# EAGLE schematic Motherboard (EAGLE 9.5.0)
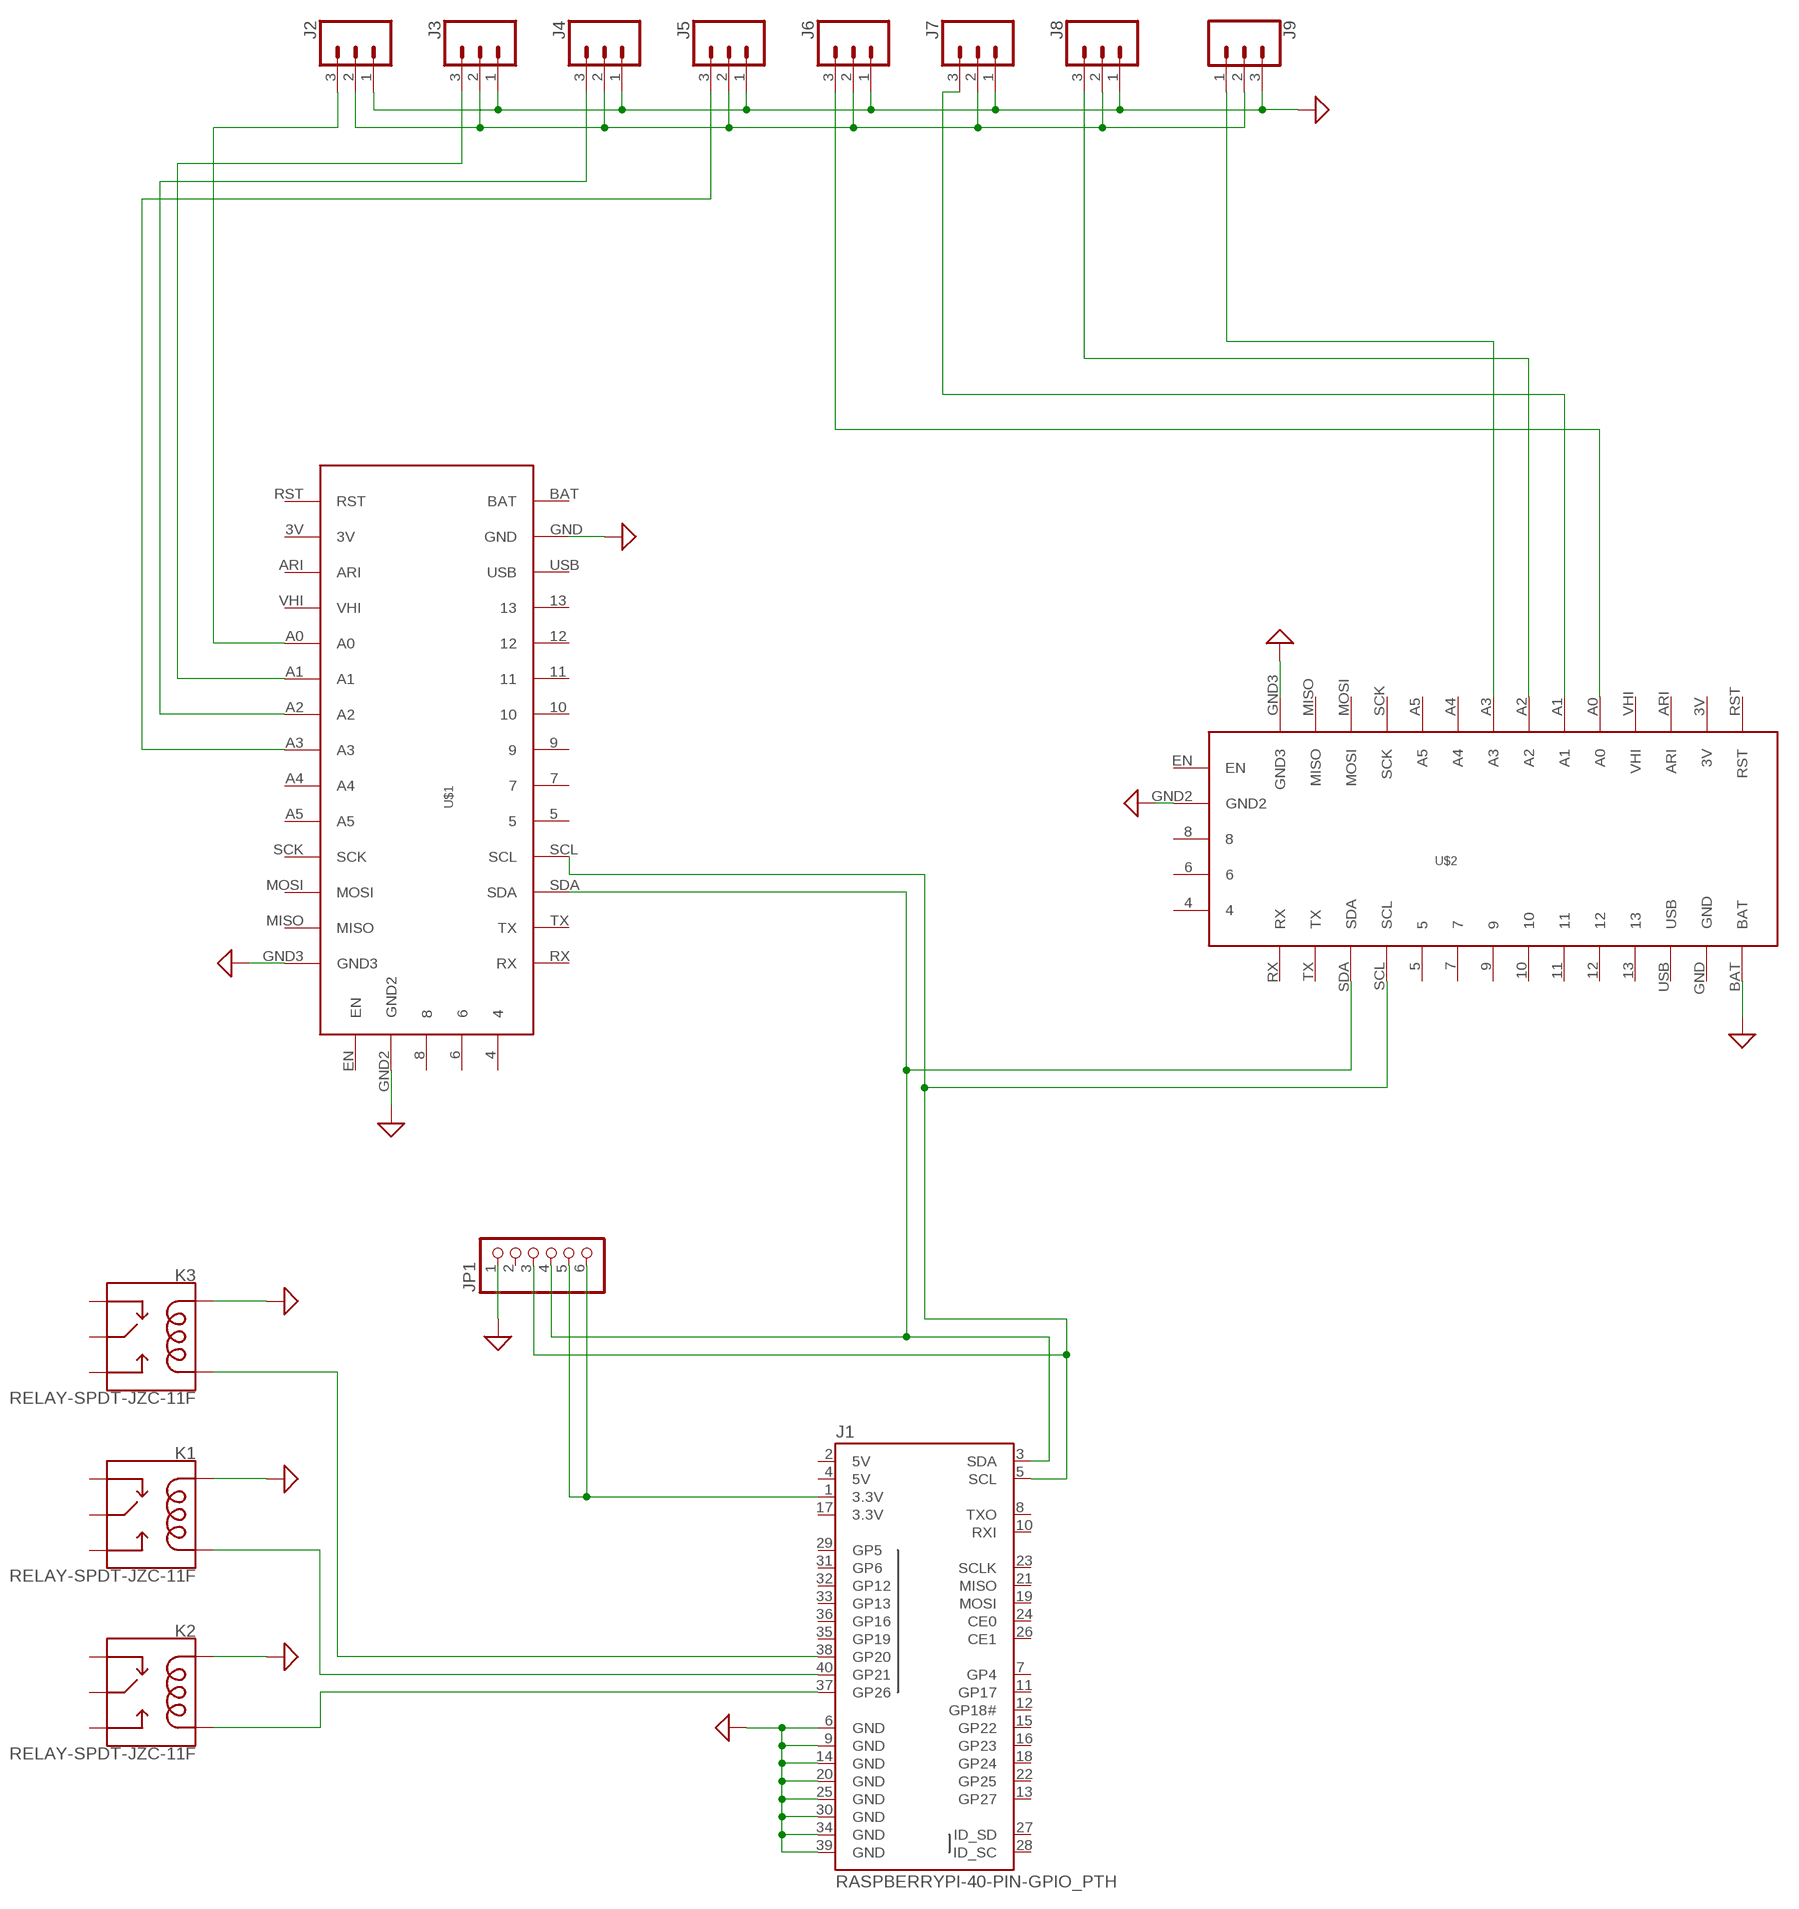
[diagram p0: schematic, sheet 1]

## Parts
J1  RASPBERRYPI-40-PIN-GPIO_PTH  [2X20_SHROUDED]
J2  CONN_03JST-PTH  [JST-3-PTH]
J3  CONN_03JST-PTH  [JST-3-PTH]
J4  CONN_03JST-PTH  [JST-3-PTH]
J5  CONN_03JST-PTH  [JST-3-PTH]
J6  CONN_03JST-PTH  [JST-3-PTH]
J7  CONN_03JST-PTH  [JST-3-PTH]
J8  CONN_03JST-PTH  [JST-3-PTH]
J9  CONN_03JST-PTH  [JST-3-PTH]
JP1  PINHD-1X6B  [1X06-BIG]
K1  RELAY-SPDT-JZC-11F  [RELAY-JZC]
K2  RELAY-SPDT-JZC-11F  [RELAY-JZC]
K3  RELAY-SPDT-JZC-11F  [RELAY-JZC]
U$1  ITSY_BITSY  [ITSY_BITSY]
U$2  ITSY_BITSY  [ITSY_BITSY]

## Nets
GND: J1.6(GND) J1.9(GND) J1.14(GND) J1.20(GND) J1.25(GND) J1.30(GND) J1.34(GND) J1.39(GND) J2.1 J3.1 J4.1 J5.1 J6.1 J7.1 J8.1 J9.3 JP1.1 K1.5(COIL1) K2.5(COIL1) K3.5(COIL1) U$1.GND U$1.GND2 U$1.GND3 U$2.BAT U$2.GND2 U$2.GND3 ; supply symbol labelled SUP
N$1: J1.3(SDA) JP1.4 U$1.SDA U$2.SDA
N$2: J1.5(SCL) JP1.3 U$1.SCL U$2.SCL
N$3: J2.2 J3.2 J4.2 J5.2 J6.2 J7.2 J8.2 J9.2
N$4: J2.3 U$1.A0
N$5: J1.37(GP26) K2.1(COIL2)
N$6: J3.3 U$1.A1
N$7: J4.3 U$1.A2
N$8: J5.3 U$1.A3
N$9: J6.3 U$2.A0
N$10: J1.40(GP21) K1.1(COIL2)
N$11: J7.3 U$2.A1
N$12: J8.3 U$2.A2
N$13: J9.1 U$2.A3
N$14: J1.38(GP20) K3.1(COIL2)
N$17: J1.1(3.3V) JP1.5 JP1.6
Unconnected: J1.7(GP4) J1.8(TXO) J1.10(RXI) J1.11(GP17) J1.12(GP18#) J1.13(GP27) J1.15(GP22) J1.16(GP23) J1.18(GP24) J1.19(MOSI) J1.21(MISO) J1.22(GP25) J1.23(SCLK) J1.24(CE0) J1.26(CE1) J1.27(ID_SD) J1.28(ID_SC) J1.29(GP5) J1.31(GP6) J1.32(GP12) J1.33(GP13) J1.35(GP19) J1.36(GP16) JP1.2 K1.2(NC) K1.3(NO) K1.4(MAIN) K2.2(NC) K2.3(NO) K2.4(MAIN) K3.2(NC) K3.3(NO) K3.4(MAIN) U$1.3V U$1.4 U$1.5 U$1.6 U$1.7 U$1.8 U$1.9 U$1.10 U$1.11 U$1.12 U$1.13 U$1.A4 U$1.A5 U$1.ARI U$1.BAT U$1.EN U$1.MISO U$1.MOSI U$1.RST U$1.RX U$1.SCK U$1.TX U$1.USB U$1.VHI U$2.3V U$2.4 U$2.5 U$2.6 U$2.7 U$2.8 U$2.9 U$2.10 U$2.11 U$2.12 U$2.13 U$2.A4 U$2.A5 U$2.ARI U$2.EN U$2.GND U$2.MISO U$2.MOSI U$2.RST U$2.RX U$2.SCK U$2.TX U$2.USB U$2.VHI

## Power pins joined to a net without a drawn wire
3.3V: J1.17(3.3V)
5V: J1.2(5V) J1.4(5V)

## Library data of the parts
J1 = SparkFun-Connectors:RASPBERRYPI-40-PIN-GPIO: Raspberry Pi GPIO Header 2x20 pin connector, as found on B, B+, A+ models. Both shrouded PTH and SMT versions available. SparkFun Products: GPIO Shrouded Header <https://www.sparkfun.com/products/13054>- PTH SparkFun Pi Wedge (Preassembled) <https://www.sparkfun.com/products/13717>; PROD_ID: CONN-12263; SF_ID: PRT-13054
J2-J9 = SparkFun-Connectors:CONN_03: Multi connection point. Often used as Generic Header-pin footprint for 0.1 inch spaced/style header connections On any of the 0.1 inch spaced packages, you can populate with these: Break Away Headers - Straight <https://www.sparkfun.com/products/116> (PRT-00116) Break Away Male Headers - Right Angle <https://www.sparkfun.com/products/553> (PRT-00553) Female Headers <https://www.sparkfun.com/products/115> (PRT-00115) Break Away Headers - Machine Pin <https://www.sparkfun.com/products/117> (PRT-00117) Break Away Female Headers - Swiss Machine Pin <https://www.sparkfun.com/products/743> (PRT-00743) Stackable Header - 3 Pin (Female, 0.1") <https://www.sparkfun.com/products/13875> (PRT-13875) For SCREWTERMINALS and SPRING TERMINALS visit here: Screw Terimnals on SparkFun.com <https://www.sparkfun.com/search/results?term=Screw+Terminals> (5mm/3.5mm/2.54mm spacing) This device is also useful as a general connection point to wire up your design to another part of your project. Our various solder wires solder well into these plated through hole pads. Hook-Up Wire - Assortment (Stranded, 22 AWG) <https://www.sparkfun.com/products/11375> (PRT-11375) Hook-Up Wire - Assortment (Solid Core, 22 AWG) <https://www.sparkfun.com/products/11367> (PRT-11367) View the entire wire category on our website here <https://www.sparkfun.com/categories/141> Special notes: Molex polarized connector foot print use with SKU : PRT-08232 with associated crimp pins and housings.; PROD_ID: WIRE-10037; SF_ID: PRT-09915
JP1 = adafruit:PINHD-1X6: PIN HEADER
K1-K3 = SparkFun-Electromechanical:RELAY-SPDT: SPDT Electromechanical Relay Single-pole, double-throw sealed relays. When current is applied to the coil, it throws a simple changeover switch, terminating the connection from the NC contact to ground and closing the NO contact. Use them to switch high voltage/high current devices. SparkFun Products JQX-15F: Relay SPDT Sealed - 20A <https://www.sparkfun.com/products/10924> (COM-10924) JZC-11F: Relay SPDT Sealed <https://www.sparkfun.com/products/100> (COM-00100); PROD_ID: COMP-09533; SF_SKU: COM-00100
U$1 U$2 = Julie_Iaccarino:ITSY_BITSY